# Altium project ADF4351.PrjPCB
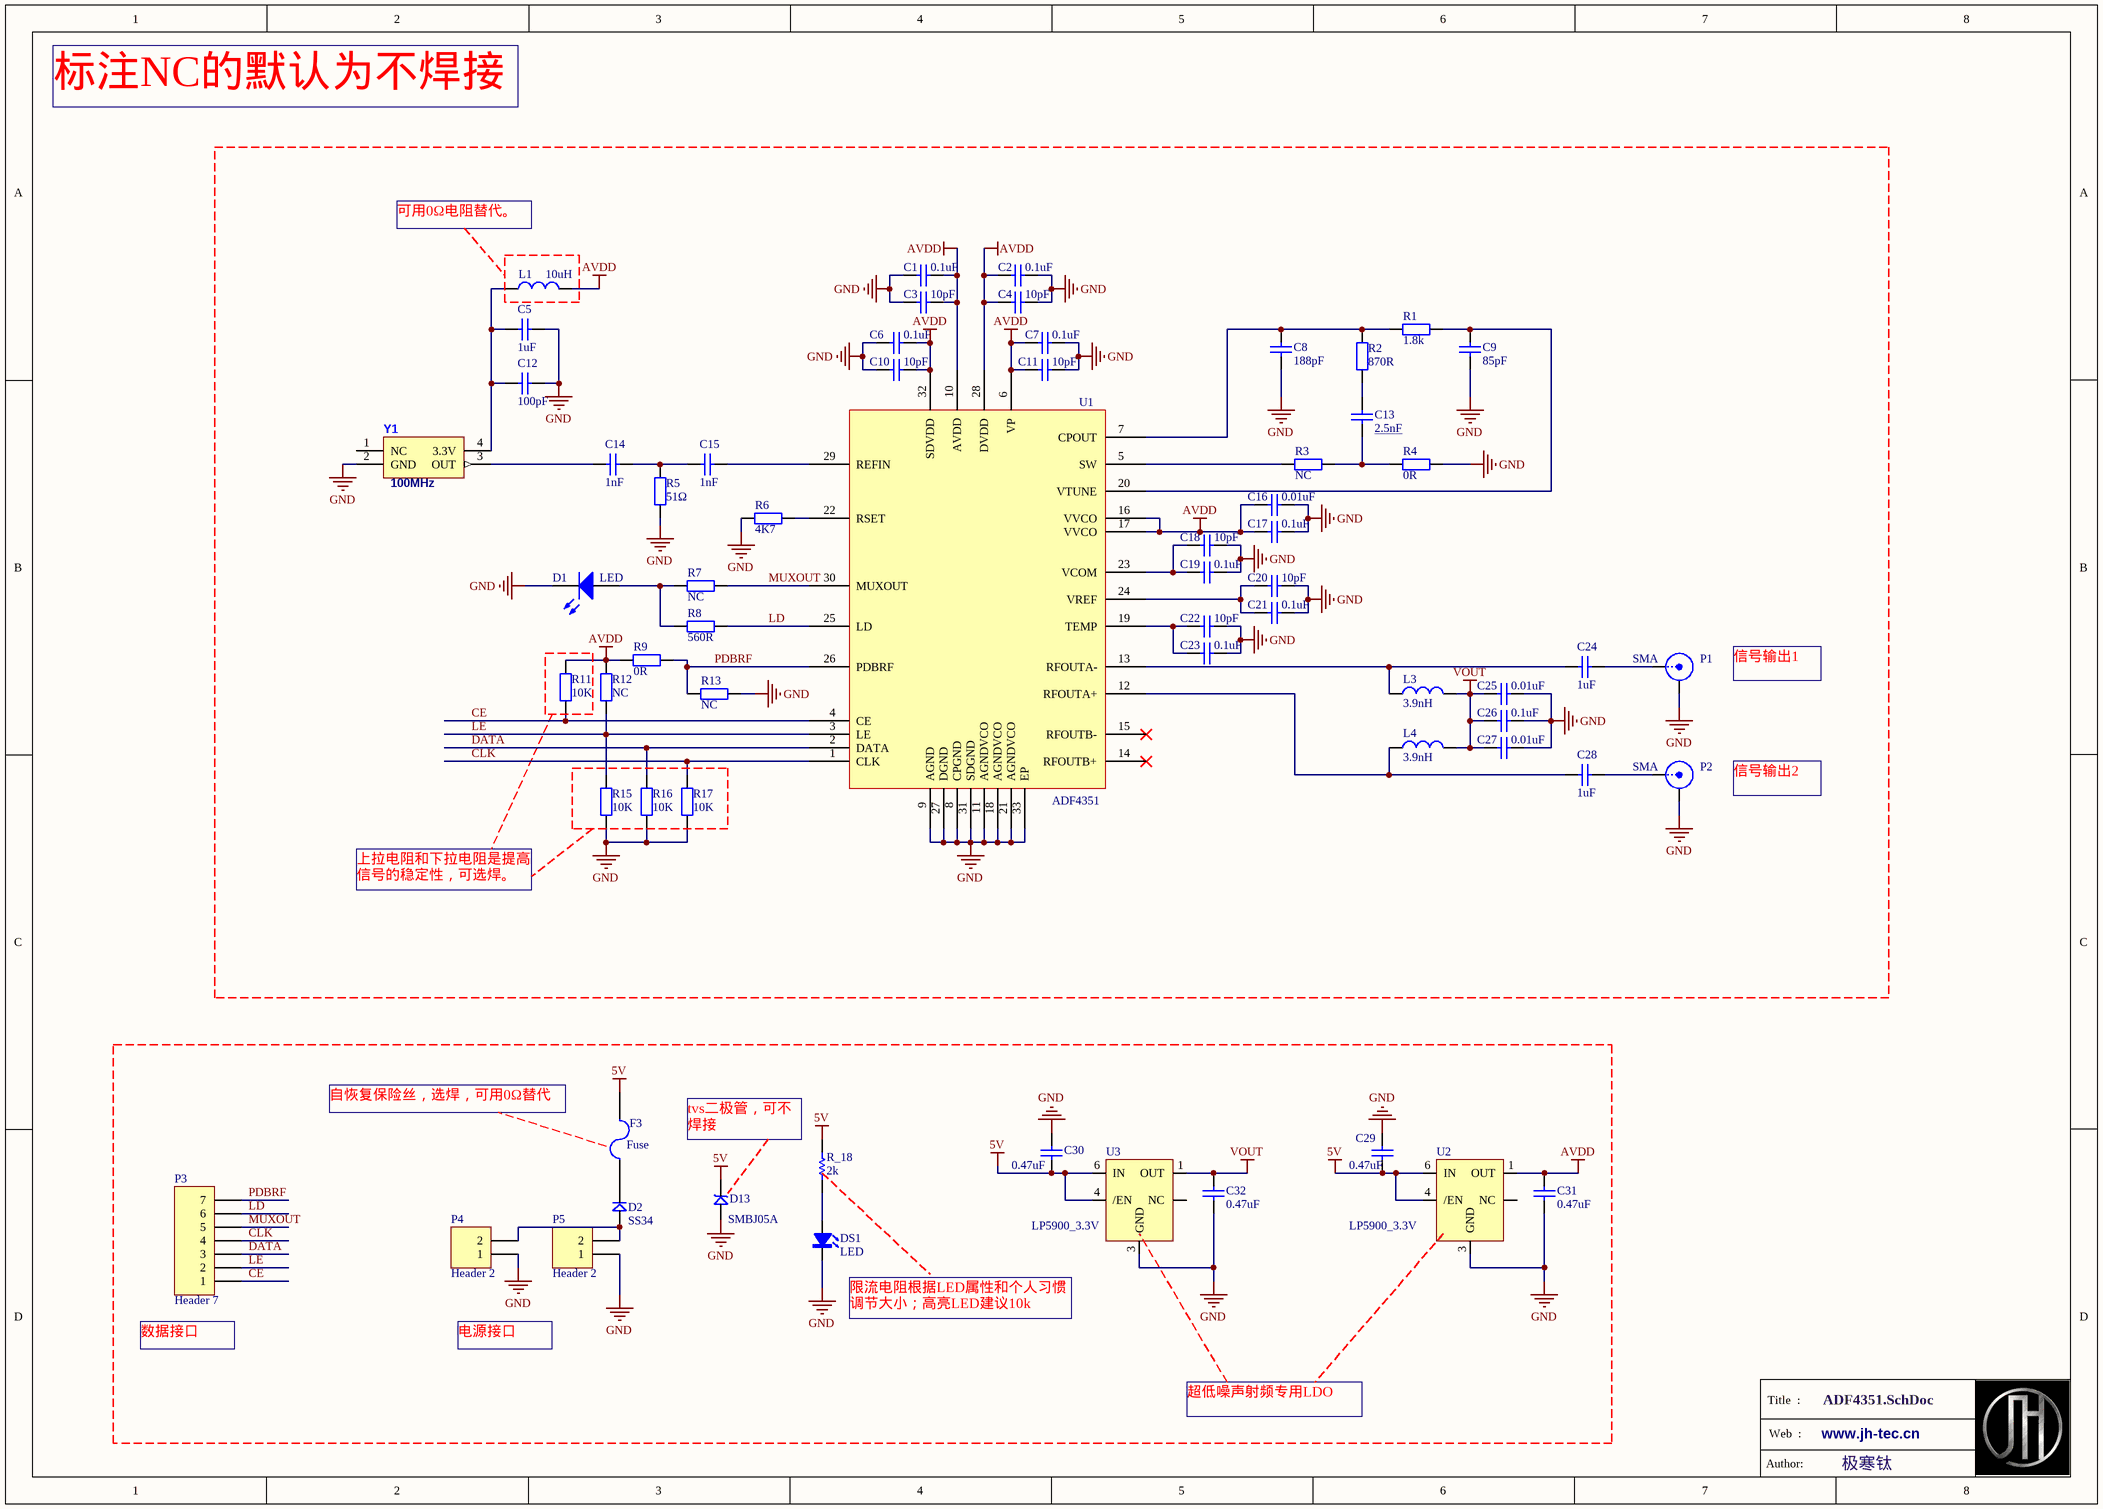
[diagram p0: ADF4351.SchDoc]
1 sheet, 65 parts. Net scope: global (net labels, ports and power ports of the same name join across sheets).
Board file: ADF4351.PcbDoc

## Sheet ADF4351.SchDoc
size A3

### Parts
C1  0.1uF  [0603R]
C2  0.1uF  [0603R]
C3  10pF  [0603R]
C4  10pF  [0603R]
C5  1uF  [0603R]
C6  0.1uF  [0603R]
C7  0.1uF  [0603R]
C8  188pF  [0603R]
C9  85pF  [0603R]
C10  10pF  [0603R]
C11  10pF  [0603R]
C12  100pF  [0603R]
C13  2.5nF  [0603R]
C14  1nF  [0603R]
C15  1nF  [0603R]
C16  0.01uF  [0603R]
C17  0.1uF  [0603R]
C18  10pF  [0603R]
C19  0.1uF  [0603R]
C20  10pF  [0603R]
C21  0.1uF  [0603R]
C22  10pF  [0603R]
C23  0.1uF  [0603R]
C24  1uF  [0603R]
C25  0.01uF  [0603R]
C26  0.1uF  [0603R]
C27  0.01uF  [0603R]
C28  1uF  [0603R]
C29  0.47uF  [0603R]
C30  0.47uF  [0603R]
C31  0.47uF  [0603R]
C32  0.47uF  [0603R]
D1  LED  [0603_LED]
D2  SS34  [SS34]
D13  SMBJ05A  [SMBJ]
DS1  LED  [0603_LED]
F3  Fuse  [0805+]
L1  10uH  [0603R]
L3  3.9nH  [0603R]
L4  3.9nH  [0603R]
P1  SMA  [SMA_3D]
P2  SMA  [SMA_3D]
P3  Header 7  [HDR1X7]
P4  Header 2  [DC2]
P5  Header 2  [HDR1X2]
R1  1.8k  [0603R]
R2  870R  [0603R]
R3  NC  [0603R]
R4  0R  [0603R]
R5  51Ω  [0603R]
R6  4K7  [0603R]
R7  NC  [0603R]
R8  560R  [0603R]
R9  0R  [0603R]
R11  10K  [0603R]
R12  NC  [0603R]
R13  NC  [0603R]
R15  10K  [0603R]
R16  10K  [0603R]
R17  10K  [0603R]
R_18  2k  [0603R]
U1  ADF4351  [ADF4351]
U2  LP5900_3.3V  [WSON_6]
U3  LP5900_3.3V  [WSON_6]
Y1  100MHz  [X3225]

### Nets
5V: C29.1 C30.1 D13.2 F3.1 R_18.1 U2.4(/EN) U2.6(IN) U3.4(/EN) U3.6(IN)
AVDD: C1.2 C2.1 C3.2 C4.1 C6.2 C7.1 C10.2 C11.1 C16.1 C17.1 C31.1 L1.2 R9.1 R11.2 R12.2 U1.6(VP) U1.10(AVDD) U1.16(VVCO) U1.17(VVCO) U1.28(DVDD) U1.32(SDVDD) U2.1(OUT)
GND: C1.1 C2.2 C3.1 C4.2 C5.2 C6.1 C7.2 C8.2 C9.2 C10.1 C11.2 C12.2 C16.2 C17.2 C18.2 C19.2 C20.2 C21.2 C22.2 C23.2 C25.2 C26.2 C27.2 C29.2 C30.2 C31.2 C32.2 D1.2 D13.1 DS1.2 P1.2(Y) P2.2(Y) P4.1 P5.1 R4.2 R5.1 R6.2 R13.2 R15.1 R16.1 R17.1 U1.8(CPGND) U1.9(AGND) U1.11(AGNDVCO) U1.18(AGNDVCO) U1.21(AGNDVCO) U1.27(DGND) U1.31(SDGND) U1.33(EP) U2.3(GND) U3.3(GND) Y1.2(GND)
VOUT: C25.1 C26.1 C27.1 C32.1 L3.2 L4.2 U3.1(OUT)
CE: P3.1 R11.1 U1.4(CE)
CLK: P3.4 R17.2 U1.1(CLK)
DATA: P3.3 R16.2 U1.2(DATA)
LD: P3.6 R8.2 U1.25(LD)
LE: P3.2 R12.1 R15.2 U1.3(LE)
MUXOUT: P3.5 R7.2 U1.30(MUXOUT)
PDBRF: P3.7 R9.2 R13.1 U1.26(PDBRF)
NetC5_1: C5.1 C12.1 L1.1 Y1.4(3.3V)
NetC8_1: C8.1 R1.1 R2.1 U1.7(CPOUT)
NetC9_1: C9.1 R1.2 U1.20(VTUNE)
NetC13_1: C13.1 R2.2
NetC13_2: C13.2 R3.2 R4.1
NetC14_1: C14.1 Y1.3(OUT)
NetC14_2: C14.2 C15.1 R5.2
NetC15_2: C15.2 U1.29(REFIN)
NetC18_1: C18.1 C19.1 U1.23(VCOM)
NetC20_1: C20.1 C21.1 U1.24(VREF)
NetC22_1: C22.1 C23.1 U1.19(TEMP)
NetC24_1: C24.1 L3.1 U1.13(RFOUTA-)
NetC24_2: C24.2 P1.1(X)
NetC28_1: C28.1 L4.1 U1.12(RFOUTA+)
NetC28_2: C28.2 P2.1(X)
NetD1_1: D1.1 R7.1 R8.1
NetD2_1: D2.1 P4.2 P5.2
NetD2_2: D2.2 F3.2
NetDS1_1: DS1.1 R_18.2
NetR3_1: R3.1 U1.5(SW)
NetR6_1: R6.1 U1.22(RSET)

Not connected (* = marked no-connect by the designer): U1 14(RFOUTB+)* 15(RFOUTB-)*; Y1 1(NC)

### Notes on the sheet
- 标注NC的默认为不焊接
- 可用0Ω电阻替代。
- 信号输出1
- 信号输出2
- 上拉电阻和下拉电阻是提高信号的稳定性，可选焊。
- 自恢复保险丝，选焊，可用0Ω替代
- (near R_18) tvs二极管，可不焊接
- 限流电阻根据LED属性和个人习惯调节大小；高亮LED建议10k
- (near P3) 数据接口
- 电源接口
- 超低噪声射频专用LDO
- Title  :
- Web  :
- www.jh-tec.cn
- Author:
- 极寒钛

### Library data of the parts
C1-C28 = C: Unpolar Capacitor
C29-C32 = cap
D1 = LED_0603
D2 = D: 1N4148
D13 = SMBJ: TVS
F3 = Fuse 2: Published: 8-Jun-2000; LatestRevisionDate: 17-Jul-2002; LatestRevisionNote: Re-released for DXP Platform.; PackageReference: PIN-W2/E2.8; Publisher: Altium Limited; PackageDescription: Thru-Hole; 2 Leads
L1 L3 L4 = INDUCTOR
P1 P2 = SMA: Port for HF signal
P3 = Header 7: Header, 7-Pin; LatestRevisionDate: 17-Jul-2002; LatestRevisionNote: Re-released for DXP Platform.; Publisher: Altium Limited
P4 P5 = Header 2: Header, 2-Pin; LatestRevisionDate: *; LatestRevisionNote: *; Publisher: *
R1-R9 R11-R13 R15-R17 = R: Resister
R_18 = RES0805
U1 = ADF4351BCPZ: Wideband Synthesizer with Integrated VCO; RefDes: RefDes; Type: DEV; Value: Value
U2 U3 = lp5900
Y1 = XTALCOSC: XTAL